# EAGLE schematic SCH1001-002-009-320 - ALU Top (EAGLE 9.4.2)

## Sheet 1 of 4
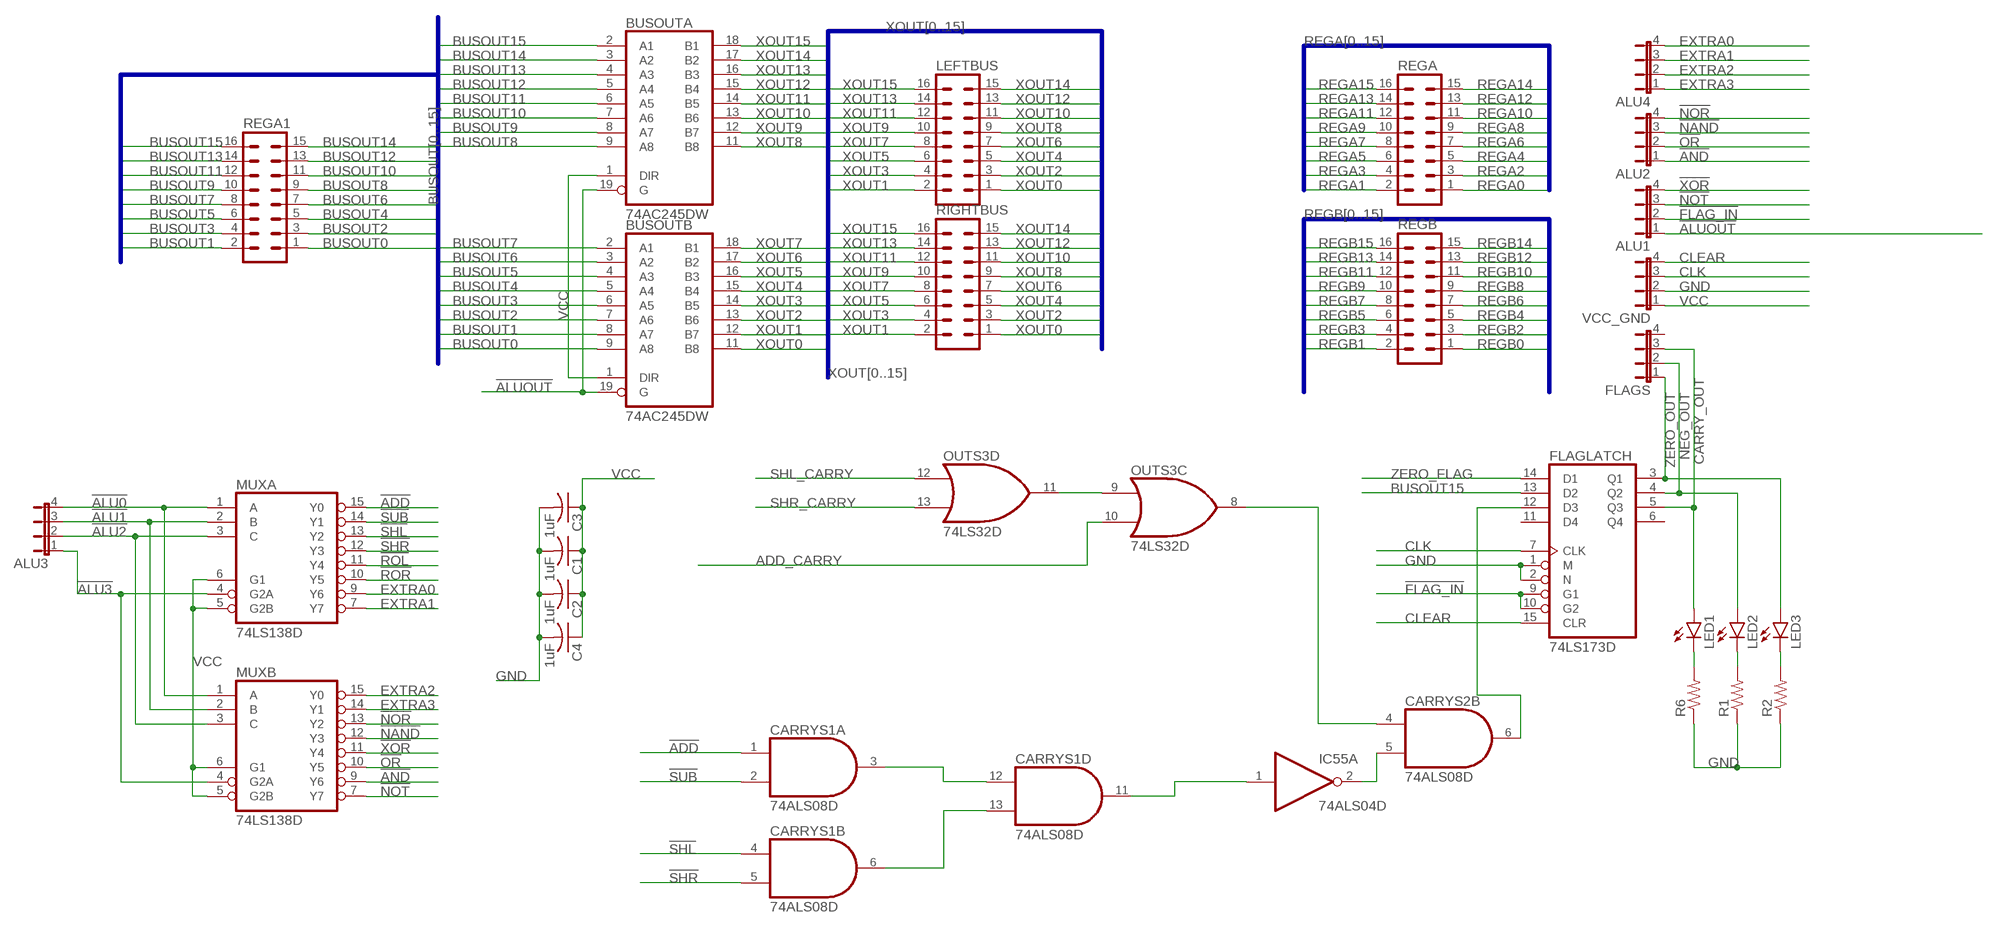
[diagram p0: schematic, sheet 1]

### Parts
ALU1  JP4E  [JP4]
ALU2  JP4E  [JP4]
ALU3  JP4E  [JP4]
ALU4  JP4E  [JP4]
BUSOUTA  74AC245DW  [SO20W]
BUSOUTB  74AC245DW  [SO20W]
C1  1uF  C-USC1206  [C1206]
C2  1uF  C-USC1206  [C1206]
C3  1uF  C-USC1206  [C1206]
C4  1uF  C-USC1206  [C1206]
CARRYS1  74ALS08D  [SO14]
CARRYS2  74ALS08D  [SO14]
FLAGLATCH  74LS173D  [SO16]
FLAGS  JP4E  [JP4]
IC55  74ALS04D  [SO14]
LED1  LED5MM  [LED5MM]
LED2  LED5MM  [LED5MM]
LED3  LED5MM  [LED5MM]
LEFTBUS  ML16  [ML16]
MUXA  74LS138D  [SO16]
MUXB  74LS138D  [SO16]
OUTS3  74LS32D  [SO14]
R1  R-US_M1206  [M1206]
R2  R-US_M1206  [M1206]
R6  R-US_M1206  [M1206]
REGA  ML16  [ML16]
REGA1  ML16  [ML16]
REGB  ML16  [ML16]
RIGHTBUS  ML16  [ML16]
VCC_GND  JP4E  [JP4]

### Nets
!ADD: CARRYS1.1(A:I0) MUXA.15(Y0) ; also sheet 4
!ALU0: ALU3.4 MUXA.1(A) MUXB.1(A)
!ALU1: ALU3.3 MUXA.2(B) MUXB.2(B)
!ALU2: ALU3.2 MUXA.3(C) MUXB.3(C)
!ALU3: ALU3.1 MUXA.4(G2A) MUXB.4(G2A)
!ALUOUT: ALU1.1 BUSOUTA.19(G) BUSOUTB.19(G)
!AND: ALU2.1 MUXB.9(Y6)
!FLAG_IN: ALU1.2 FLAGLATCH.9(G1) FLAGLATCH.10(G2)
!NAND: ALU2.3 MUXB.12(Y3)
!NOR: ALU2.4 MUXB.13(Y2)
!NOT: ALU1.3 MUXB.7(Y7)
!OR: ALU2.2 MUXB.10(Y5)
!ROL: MUXA.11(Y4) ; also sheet 2
!ROR: MUXA.10(Y5) ; also sheet 2
!SHL: CARRYS1.4(B:I0) MUXA.13(Y2) ; also sheet 2
!SHR: CARRYS1.5(B:I1) MUXA.12(Y3) ; also sheet 2
!SUB: CARRYS1.2(A:I1) MUXA.14(Y1) ; also sheet 4
!XOR: ALU1.4 MUXB.11(Y4)
ADD_CARRY: OUTS3.10(C:I1) ; also sheet 4
BUSOUT0: BUSOUTB.9(A8) REGA1.1 ; also sheet 2,4
BUSOUT1: BUSOUTB.8(A7) REGA1.2 ; also sheet 2,4
BUSOUT2: BUSOUTB.7(A6) REGA1.3 ; also sheet 2,4
BUSOUT3: BUSOUTB.6(A5) REGA1.4 ; also sheet 2,4
BUSOUT4: BUSOUTB.5(A4) REGA1.5 ; also sheet 2,4
BUSOUT5: BUSOUTB.4(A3) REGA1.6 ; also sheet 2,4
BUSOUT6: BUSOUTB.3(A2) REGA1.7 ; also sheet 2,4
BUSOUT7: BUSOUTB.2(A1) REGA1.8 ; also sheet 2,4
BUSOUT8: BUSOUTA.9(A8) REGA1.9 ; also sheet 2,4
BUSOUT9: BUSOUTA.8(A7) REGA1.10 ; also sheet 2,4
BUSOUT10: BUSOUTA.7(A6) REGA1.11 ; also sheet 2,4
BUSOUT11: BUSOUTA.6(A5) REGA1.12 ; also sheet 2,4
BUSOUT12: BUSOUTA.5(A4) REGA1.13 ; also sheet 2,4
BUSOUT13: BUSOUTA.4(A3) REGA1.14 ; also sheet 2,4
BUSOUT14: BUSOUTA.3(A2) REGA1.15 ; also sheet 2,4
BUSOUT15: BUSOUTA.2(A1) FLAGLATCH.13(D2) REGA1.16 ; also sheet 2,4
CARRY_OUT: FLAGLATCH.5(Q3) FLAGS.3 LED1.A
CLEAR: FLAGLATCH.15(CLR) VCC_GND.4
CLK: FLAGLATCH.7(CLK) VCC_GND.3
EXTRA0: ALU4.4 MUXA.9(Y6)
EXTRA1: ALU4.3 MUXA.7(Y7)
EXTRA2: ALU4.2 MUXB.15(Y0)
EXTRA3: ALU4.1 MUXB.14(Y1)
GND [power]: C1.2 C2.2 C3.2 C4.2 FLAGLATCH.1(M) FLAGLATCH.2(N) R1.1 R2.1 R6.1 VCC_GND.2 ; also sheet 2
N$115: OUTS3.9(C:I0) OUTS3.11(D:O)
N$118: CARRYS2.4(B:I0) OUTS3.8(C:O)
N$131: CARRYS2.6(B:O) FLAGLATCH.12(D3)
N$132: CARRYS2.5(B:I1) IC55.2(A:O)
N$134: CARRYS1.11(D:O) IC55.1(A:I)
N$135: CARRYS1.3(A:O) CARRYS1.12(D:I0)
N$136: CARRYS1.6(B:O) CARRYS1.13(D:I1)
N$138: LED1.K(C) R6.2
N$139: LED2.K(C) R1.2
N$140: LED3.K(C) R2.2
NEG_OUT: FLAGLATCH.4(Q2) FLAGS.2 LED2.A
REGA0: REGA.1 ; also sheet 2,4
REGA1: REGA.2 ; also sheet 2,4
REGA2: REGA.3 ; also sheet 2,4
REGA3: REGA.4 ; also sheet 2,4
REGA4: REGA.5 ; also sheet 2,4
REGA5: REGA.6 ; also sheet 2,4
REGA6: REGA.7 ; also sheet 2,4
REGA7: REGA.8 ; also sheet 2,4
REGA8: REGA.9 ; also sheet 2,4
REGA9: REGA.10 ; also sheet 2,4
REGA10: REGA.11 ; also sheet 2,4
REGA11: REGA.12 ; also sheet 2,4
REGA12: REGA.13 ; also sheet 2,4
REGA13: REGA.14 ; also sheet 2,4
REGA14: REGA.15 ; also sheet 2,4
REGA15: REGA.16 ; also sheet 2,4
REGB0: REGB.1 ; also sheet 4
REGB1: REGB.2 ; also sheet 4
REGB2: REGB.3 ; also sheet 4
REGB3: REGB.4 ; also sheet 4
REGB4: REGB.5 ; also sheet 4
REGB5: REGB.6 ; also sheet 4
REGB6: REGB.7 ; also sheet 4
REGB7: REGB.8 ; also sheet 4
REGB8: REGB.9 ; also sheet 4
REGB9: REGB.10 ; also sheet 4
REGB10: REGB.11 ; also sheet 4
REGB11: REGB.12 ; also sheet 4
REGB12: REGB.13 ; also sheet 4
REGB13: REGB.14 ; also sheet 4
REGB14: REGB.15 ; also sheet 4
REGB15: REGB.16 ; also sheet 4
SHL_CARRY: OUTS3.12(D:I0) ; also sheet 2
SHR_CARRY: OUTS3.13(D:I1) ; also sheet 2
VCC [power]: BUSOUTA.1(DIR) BUSOUTB.1(DIR) C1.1 C2.1 C3.1 C4.1 MUXA.5(G2B) MUXA.6(G1) MUXB.5(G2B) MUXB.6(G1) VCC_GND.1 ; also sheet 2,4
XOUT0: BUSOUTB.11(B8) LEFTBUS.1 RIGHTBUS.1
XOUT1: BUSOUTB.12(B7) LEFTBUS.2 RIGHTBUS.2
XOUT2: BUSOUTB.13(B6) LEFTBUS.3 RIGHTBUS.3
XOUT3: BUSOUTB.14(B5) LEFTBUS.4 RIGHTBUS.4
XOUT4: BUSOUTB.15(B4) LEFTBUS.5 RIGHTBUS.5
XOUT5: BUSOUTB.16(B3) LEFTBUS.6 RIGHTBUS.6
XOUT6: BUSOUTB.17(B2) LEFTBUS.7 RIGHTBUS.7
XOUT7: BUSOUTB.18(B1) LEFTBUS.8 RIGHTBUS.8
XOUT8: BUSOUTA.11(B8) LEFTBUS.9 RIGHTBUS.9
XOUT9: BUSOUTA.12(B7) LEFTBUS.10 RIGHTBUS.10
XOUT10: BUSOUTA.13(B6) LEFTBUS.11 RIGHTBUS.11
XOUT11: BUSOUTA.14(B5) LEFTBUS.12 RIGHTBUS.12
XOUT12: BUSOUTA.15(B4) LEFTBUS.13 RIGHTBUS.13
XOUT13: BUSOUTA.16(B3) LEFTBUS.14 RIGHTBUS.14
XOUT14: BUSOUTA.17(B2) LEFTBUS.15 RIGHTBUS.15
XOUT15: BUSOUTA.18(B1) LEFTBUS.16 RIGHTBUS.16
ZERO_FLAG: FLAGLATCH.14(D1) ; also sheet 4
ZERO_OUT: FLAGLATCH.3(Q1) FLAGS.1 LED3.A
Unconnected: CARRYS1.8(C:O) CARRYS1.9(C:I0) CARRYS1.10(C:I1) CARRYS2.1(A:I0) CARRYS2.2(A:I1) CARRYS2.3(A:O) CARRYS2.8(C:O) CARRYS2.9(C:I0) CARRYS2.10(C:I1) CARRYS2.11(D:O) CARRYS2.12(D:I0) CARRYS2.13(D:I1) FLAGLATCH.6(Q4) FLAGLATCH.11(D4) FLAGS.4 IC55.3(B:I) IC55.4(B:O) IC55.5(C:I) IC55.6(C:O) IC55.8(D:O) IC55.9(D:I) IC55.10(E:O) IC55.11(E:I) IC55.12(F:O) IC55.13(F:I) OUTS3.1(A:I0) OUTS3.2(A:I1) OUTS3.3(A:O) OUTS3.4(B:I0) OUTS3.5(B:I1) OUTS3.6(B:O)

### Buses
REGB[0..15]
REGA[0..15]
XOUT[0..15]
BUSOUT[0..15]

## Sheet 2 of 4
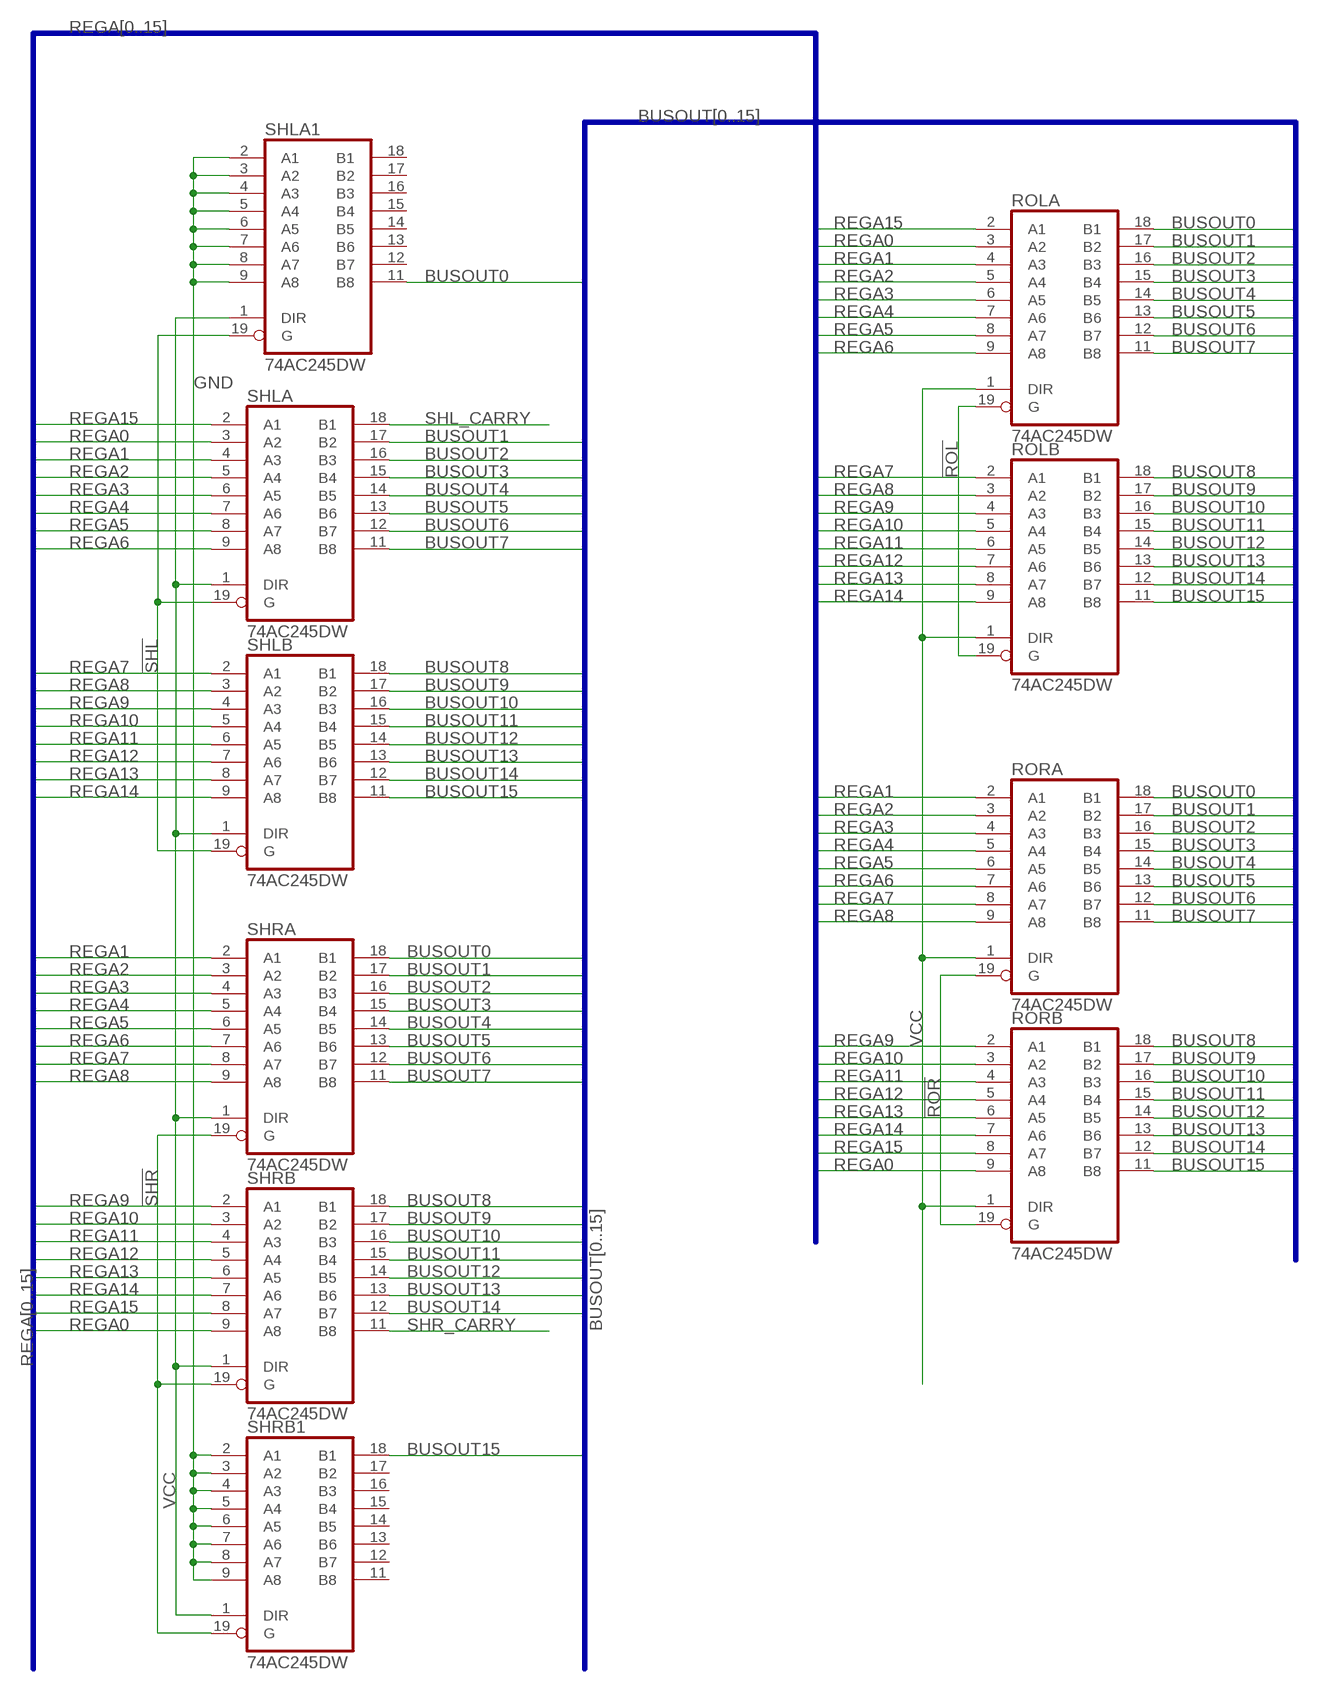
[diagram p1: schematic, sheet 2]

### Parts
ROLA  74AC245DW  [SO20W]
ROLB  74AC245DW  [SO20W]
RORA  74AC245DW  [SO20W]
RORB  74AC245DW  [SO20W]
SHLA  74AC245DW  [SO20W]
SHLA1  74AC245DW  [SO20W]
SHLB  74AC245DW  [SO20W]
SHRA  74AC245DW  [SO20W]
SHRB  74AC245DW  [SO20W]
SHRB1  74AC245DW  [SO20W]

### Nets
!ROL: ROLA.19(G) ROLB.19(G) ; also sheet 1
!ROR: RORA.19(G) RORB.19(G) ; also sheet 1
!SHL: SHLA1.19(G) SHLA.19(G) SHLB.19(G) ; also sheet 1
!SHR: SHRA.19(G) SHRB1.19(G) SHRB.19(G) ; also sheet 1
BUSOUT0: ROLA.18(B1) RORA.18(B1) SHLA1.11(B8) SHRA.18(B1) ; also sheet 1,4
BUSOUT1: ROLA.17(B2) RORA.17(B2) SHLA.17(B2) SHRA.17(B2) ; also sheet 1,4
BUSOUT2: ROLA.16(B3) RORA.16(B3) SHLA.16(B3) SHRA.16(B3) ; also sheet 1,4
BUSOUT3: ROLA.15(B4) RORA.15(B4) SHLA.15(B4) SHRA.15(B4) ; also sheet 1,4
BUSOUT4: ROLA.14(B5) RORA.14(B5) SHLA.14(B5) SHRA.14(B5) ; also sheet 1,4
BUSOUT5: ROLA.13(B6) RORA.13(B6) SHLA.13(B6) SHRA.13(B6) ; also sheet 1,4
BUSOUT6: ROLA.12(B7) RORA.12(B7) SHLA.12(B7) SHRA.12(B7) ; also sheet 1,4
BUSOUT7: ROLA.11(B8) RORA.11(B8) SHLA.11(B8) SHRA.11(B8) ; also sheet 1,4
BUSOUT8: ROLB.18(B1) RORB.18(B1) SHLB.18(B1) SHRB.18(B1) ; also sheet 1,4
BUSOUT9: ROLB.17(B2) RORB.17(B2) SHLB.17(B2) SHRB.17(B2) ; also sheet 1,4
BUSOUT10: ROLB.16(B3) RORB.16(B3) SHLB.16(B3) SHRB.16(B3) ; also sheet 1,4
BUSOUT11: ROLB.15(B4) RORB.15(B4) SHLB.15(B4) SHRB.15(B4) ; also sheet 1,4
BUSOUT12: ROLB.14(B5) RORB.14(B5) SHLB.14(B5) SHRB.14(B5) ; also sheet 1,4
BUSOUT13: ROLB.13(B6) RORB.13(B6) SHLB.13(B6) SHRB.13(B6) ; also sheet 1,4
BUSOUT14: ROLB.12(B7) RORB.12(B7) SHLB.12(B7) SHRB.12(B7) ; also sheet 1,4
BUSOUT15: ROLB.11(B8) RORB.11(B8) SHLB.11(B8) SHRB1.18(B1) ; also sheet 1,4
GND [power]: SHLA1.2(A1) SHLA1.3(A2) SHLA1.4(A3) SHLA1.5(A4) SHLA1.6(A5) SHLA1.7(A6) SHLA1.8(A7) SHLA1.9(A8) SHRB1.2(A1) SHRB1.3(A2) SHRB1.4(A3) SHRB1.5(A4) SHRB1.6(A5) SHRB1.7(A6) SHRB1.8(A7) SHRB1.9(A8) ; also sheet 1
REGA0: ROLA.3(A2) RORB.9(A8) SHLA.3(A2) SHRB.9(A8) ; also sheet 1,4
REGA1: ROLA.4(A3) RORA.2(A1) SHLA.4(A3) SHRA.2(A1) ; also sheet 1,4
REGA2: ROLA.5(A4) RORA.3(A2) SHLA.5(A4) SHRA.3(A2) ; also sheet 1,4
REGA3: ROLA.6(A5) RORA.4(A3) SHLA.6(A5) SHRA.4(A3) ; also sheet 1,4
REGA4: ROLA.7(A6) RORA.5(A4) SHLA.7(A6) SHRA.5(A4) ; also sheet 1,4
REGA5: ROLA.8(A7) RORA.6(A5) SHLA.8(A7) SHRA.6(A5) ; also sheet 1,4
REGA6: ROLA.9(A8) RORA.7(A6) SHLA.9(A8) SHRA.7(A6) ; also sheet 1,4
REGA7: ROLB.2(A1) RORA.8(A7) SHLB.2(A1) SHRA.8(A7) ; also sheet 1,4
REGA8: ROLB.3(A2) RORA.9(A8) SHLB.3(A2) SHRA.9(A8) ; also sheet 1,4
REGA9: ROLB.4(A3) RORB.2(A1) SHLB.4(A3) SHRB.2(A1) ; also sheet 1,4
REGA10: ROLB.5(A4) RORB.3(A2) SHLB.5(A4) SHRB.3(A2) ; also sheet 1,4
REGA11: ROLB.6(A5) RORB.4(A3) SHLB.6(A5) SHRB.4(A3) ; also sheet 1,4
REGA12: ROLB.7(A6) RORB.5(A4) SHLB.7(A6) SHRB.5(A4) ; also sheet 1,4
REGA13: ROLB.8(A7) RORB.6(A5) SHLB.8(A7) SHRB.6(A5) ; also sheet 1,4
REGA14: ROLB.9(A8) RORB.7(A6) SHLB.9(A8) SHRB.7(A6) ; also sheet 1,4
REGA15: ROLA.2(A1) RORB.8(A7) SHLA.2(A1) SHRB.8(A7) ; also sheet 1,4
SHL_CARRY: SHLA.18(B1) ; also sheet 1
SHR_CARRY: SHRB.11(B8) ; also sheet 1
VCC [power]: ROLA.1(DIR) ROLB.1(DIR) RORA.1(DIR) RORB.1(DIR) SHLA1.1(DIR) SHLA.1(DIR) SHLB.1(DIR) SHRA.1(DIR) SHRB1.1(DIR) SHRB.1(DIR) ; also sheet 1,4
Unconnected: SHLA1.12(B7) SHLA1.13(B6) SHLA1.14(B5) SHLA1.15(B4) SHLA1.16(B3) SHLA1.17(B2) SHLA1.18(B1) SHRB1.11(B8) SHRB1.12(B7) SHRB1.13(B6) SHRB1.14(B5) SHRB1.15(B4) SHRB1.16(B3) SHRB1.17(B2)

### Buses
BUSOUT[0..15]
REGA[0..15]

## Sheet 3 of 4

## Sheet 4 of 4
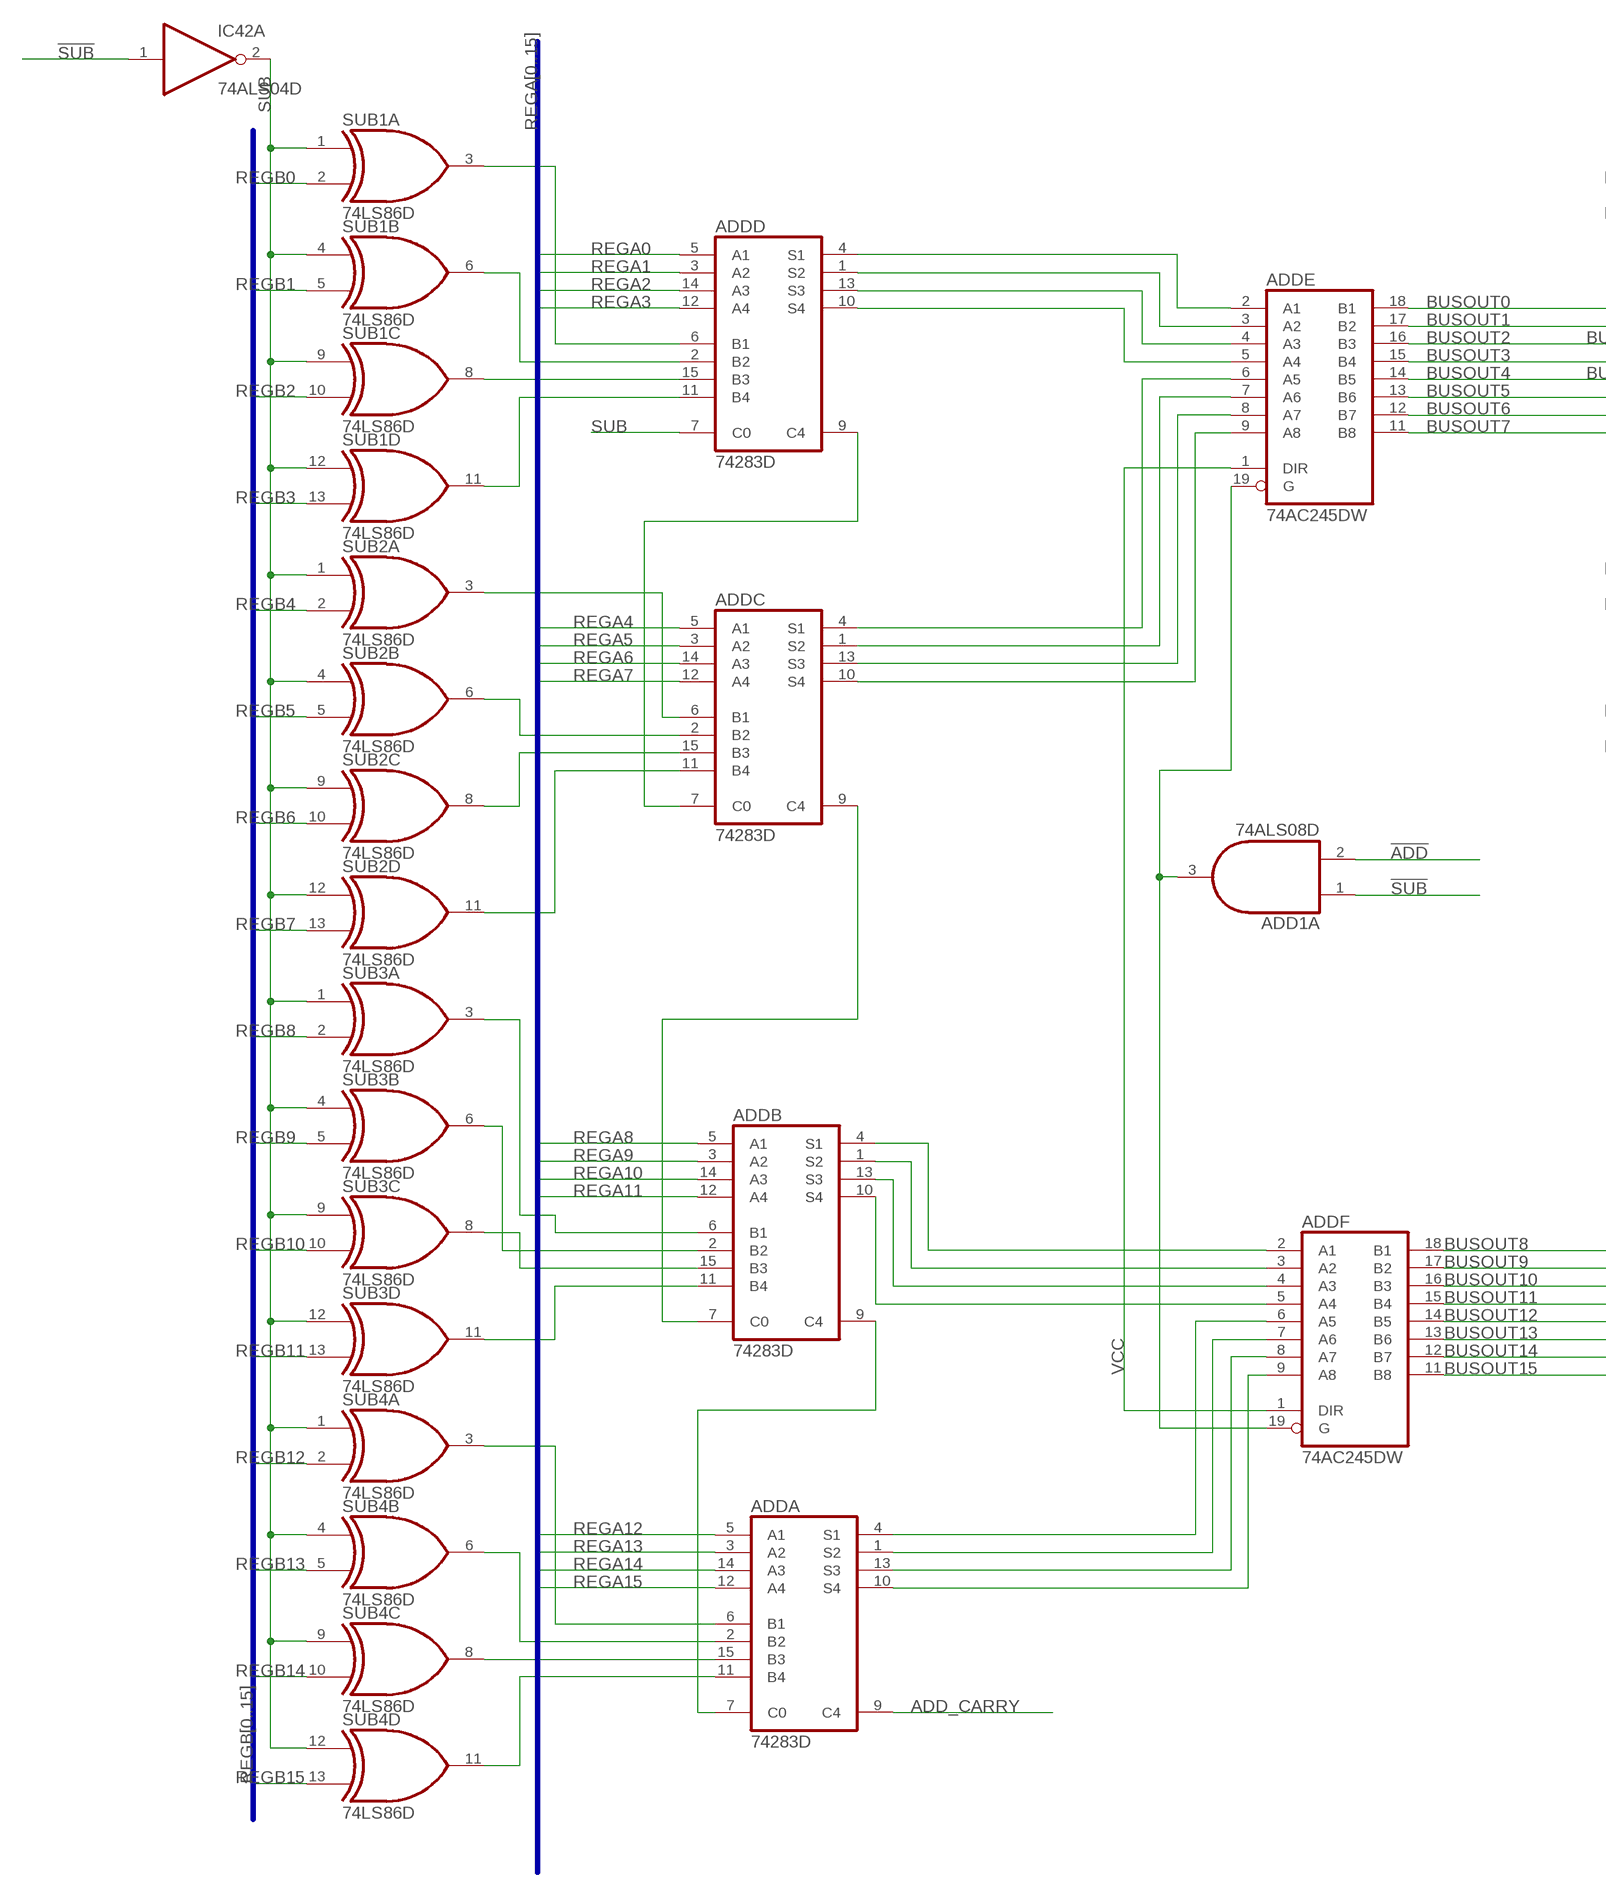
[diagram p2: schematic, sheet 4, part 1 of 2]
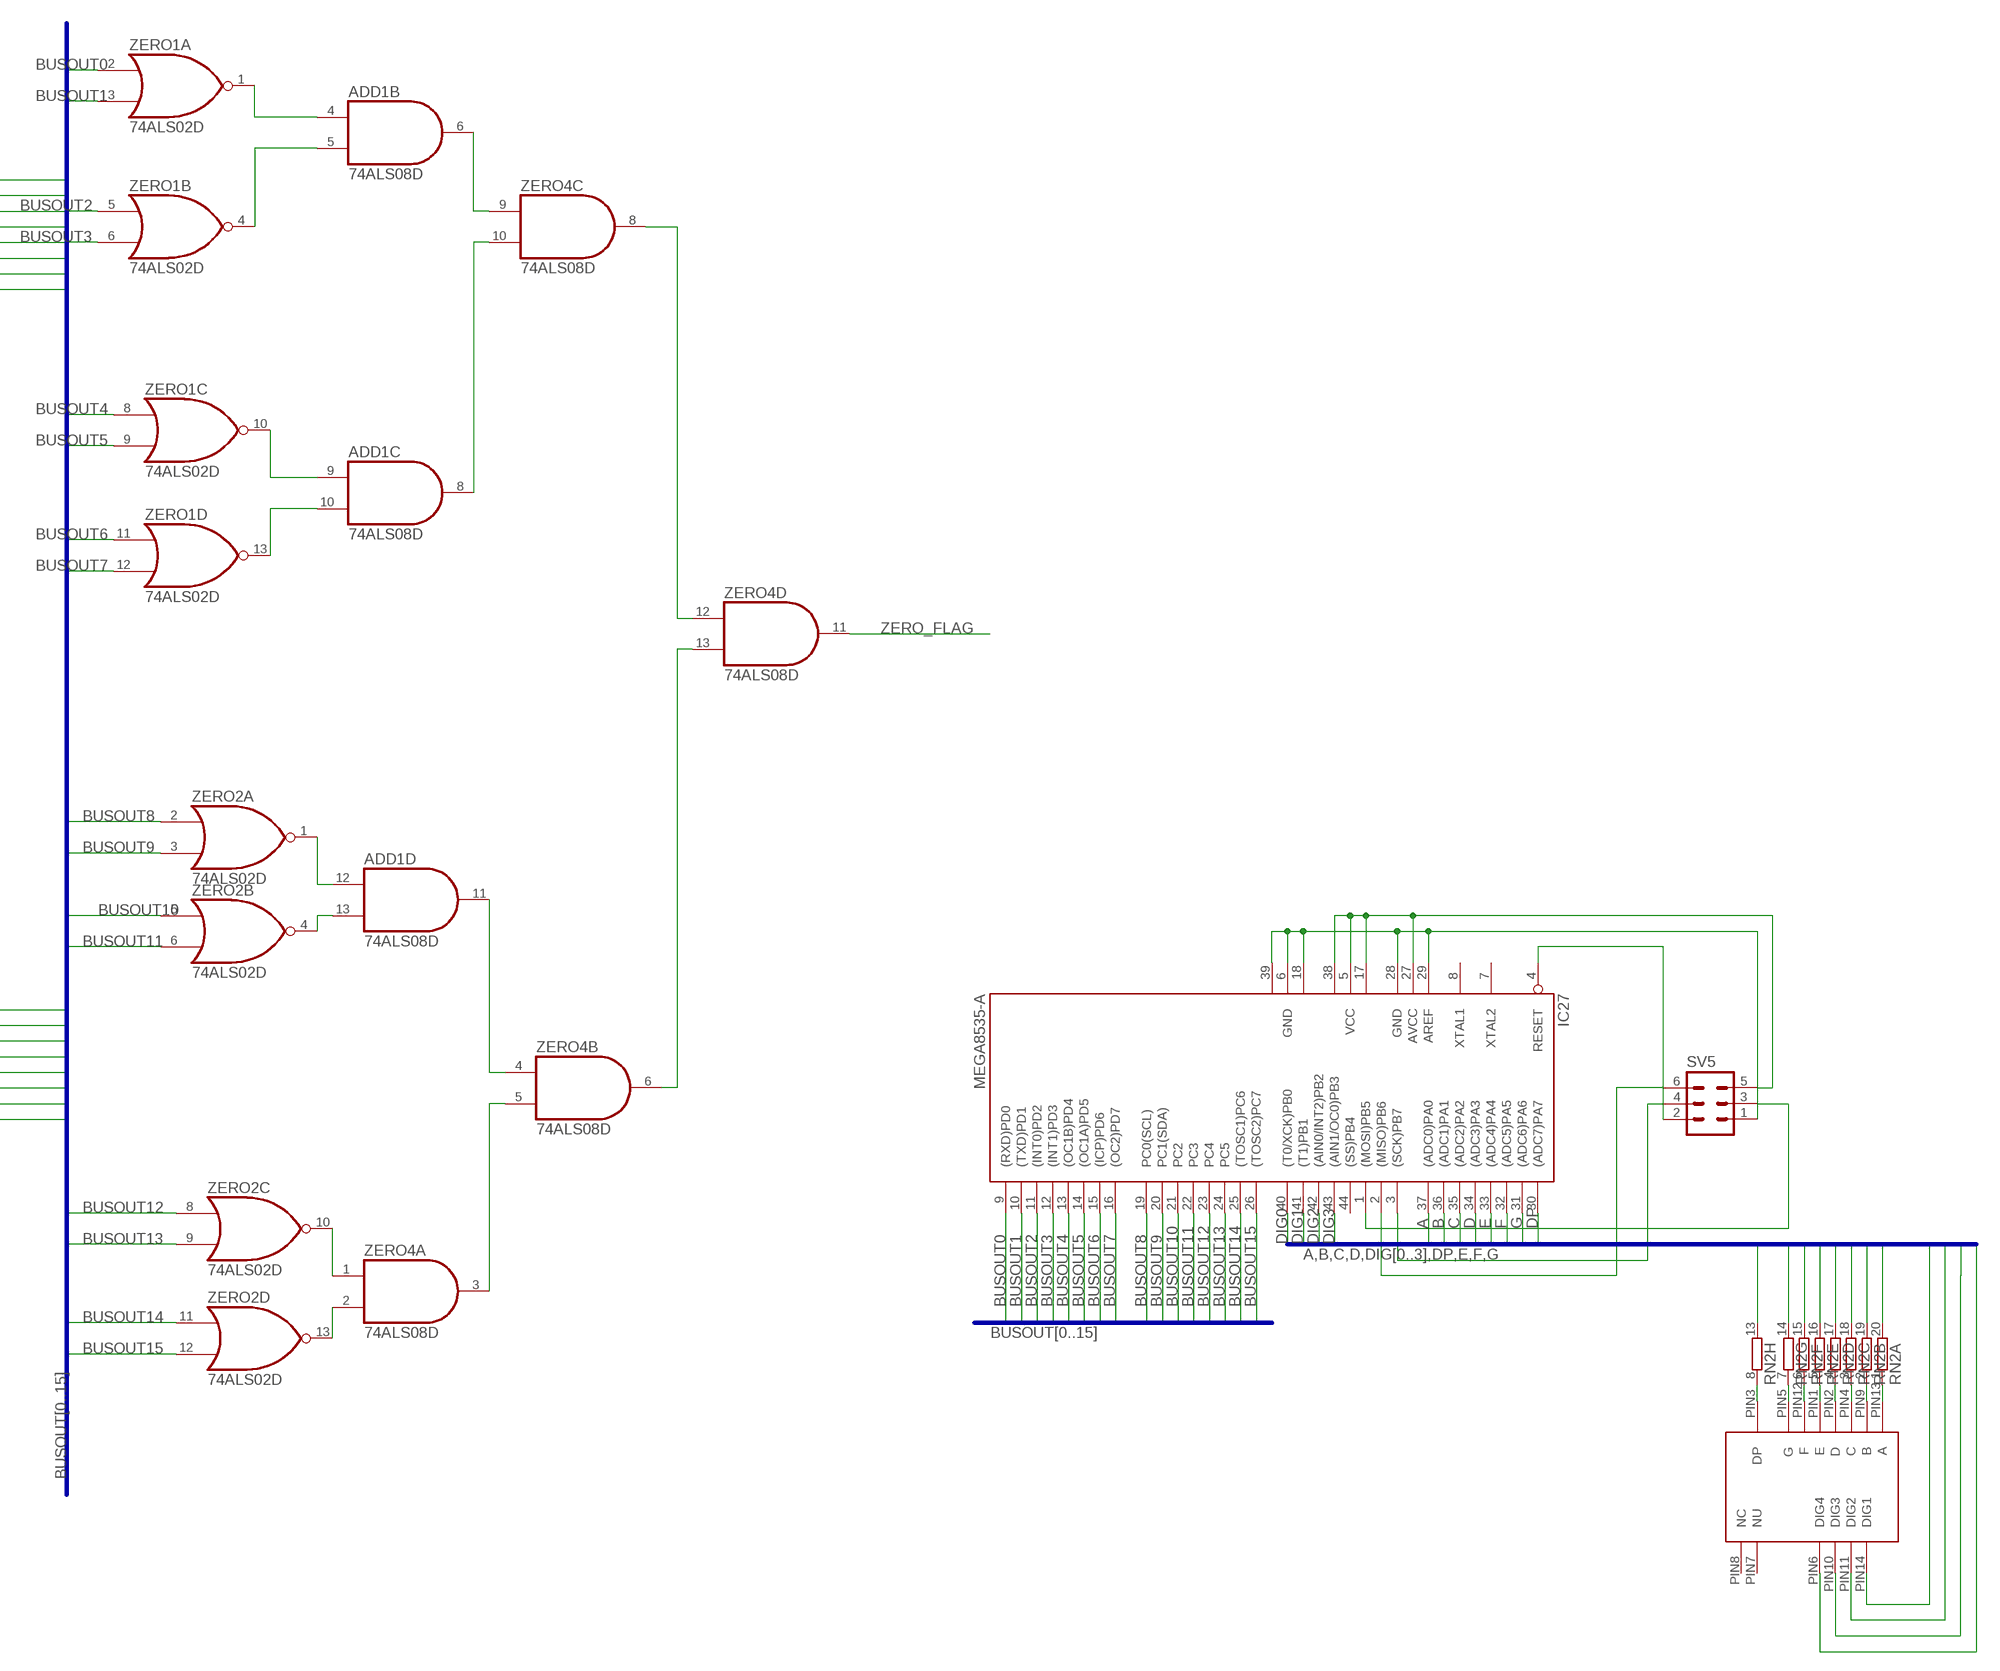
[diagram p3: schematic, sheet 4, part 2 of 2]

### Parts
ADD1  74ALS08D  [SO14]
ADDA  74283D  [SO16]
ADDB  74283D  [SO16]
ADDC  74283D  [SO16]
ADDD  74283D  [SO16]
ADDE  74AC245DW  [SO20W]
ADDF  74AC245DW  [SO20W]
IC27  MEGA8535-A  [TQFP44]
IC42  74ALS04D  [SO14]
RN2  10R-NSOMC  [SOMC20]
SUB1  74LS86D  [SO14]
SUB2  74LS86D  [SO14]
SUB3  74LS86D  [SO14]
SUB4  74LS86D  [SO14]
SV5  ML6  [ML6]
U$1  4-DIGIT-7-SEGMENT  [4-DIGIT-7-SEGMENT]
ZERO1  74ALS02D  [SO14]
ZERO2  74ALS02D  [SO14]
ZERO4  74ALS08D  [SO14]

### Nets
!ADD: ADD1.2(A:I1) ; also sheet 1
!SUB: ADD1.1(A:I0) IC42.1(A:I) ; also sheet 1
A: IC27.37((ADC0)PA0) RN2.20
ADD_CARRY: ADDA.9(C4) ; also sheet 1
B: IC27.36((ADC1)PA1) RN2.19
BUSOUT0: ADDE.18(B1) IC27.9((RXD)PD0) ZERO1.2(A:I0) ; also sheet 1,2
BUSOUT1: ADDE.17(B2) IC27.10((TXD)PD1) ZERO1.3(A:I1) ; also sheet 1,2
BUSOUT2: ADDE.16(B3) IC27.11((INT0)PD2) ZERO1.5(B:I0) ; also sheet 1,2
BUSOUT3: ADDE.15(B4) IC27.12((INT1)PD3) ZERO1.6(B:I1) ; also sheet 1,2
BUSOUT4: ADDE.14(B5) IC27.13((OC1B)PD4) ZERO1.8(C:I0) ; also sheet 1,2
BUSOUT5: ADDE.13(B6) IC27.14((OC1A)PD5) ZERO1.9(C:I1) ; also sheet 1,2
BUSOUT6: ADDE.12(B7) IC27.15((ICP)PD6) ZERO1.11(D:I0) ; also sheet 1,2
BUSOUT7: ADDE.11(B8) IC27.16((OC2)PD7) ZERO1.12(D:I1) ; also sheet 1,2
BUSOUT8: ADDF.18(B1) IC27.19(PC0(SCL)) ZERO2.2(A:I0) ; also sheet 1,2
BUSOUT9: ADDF.17(B2) IC27.20(PC1(SDA)) ZERO2.3(A:I1) ; also sheet 1,2
BUSOUT10: ADDF.16(B3) IC27.21(PC2) ZERO2.5(B:I0) ; also sheet 1,2
BUSOUT11: ADDF.15(B4) IC27.22(PC3) ZERO2.6(B:I1) ; also sheet 1,2
BUSOUT12: ADDF.14(B5) IC27.23(PC4) ZERO2.8(C:I0) ; also sheet 1,2
BUSOUT13: ADDF.13(B6) IC27.24(PC5) ZERO2.9(C:I1) ; also sheet 1,2
BUSOUT14: ADDF.12(B7) IC27.25((TOSC1)PC6) ZERO2.11(D:I0) ; also sheet 1,2
BUSOUT15: ADDF.11(B8) IC27.26((TOSC2)PC7) ZERO2.12(D:I1) ; also sheet 1,2
C: IC27.35((ADC2)PA2) RN2.18
D: IC27.34((ADC3)PA3) RN2.17
DIG0: IC27.40((T0/XCK)PB0) U$1.PIN14(DIG1)
DIG1: IC27.41((T1)PB1) U$1.PIN11(DIG2)
DIG2: IC27.42((AIN0/INT2)PB2) U$1.PIN10(DIG3)
DIG3: IC27.43((AIN1/OC0)PB3) U$1.PIN6(DIG4)
DP: IC27.30((ADC7)PA7) RN2.13
E: IC27.33((ADC4)PA4) RN2.16
F: IC27.32((ADC5)PA5) RN2.15
G: IC27.31((ADC6)PA6) RN2.14
N$65: ADDD.6(B1) SUB1.3(A:O)
N$66: ADDD.2(B2) SUB1.6(B:O)
N$67: ADDD.15(B3) SUB1.8(C:O)
N$68: ADDD.11(B4) SUB1.11(D:O)
N$69: ADDD.4(S1) ADDE.2(A1)
N$70: ADDD.1(S2) ADDE.3(A2)
N$73: ADDC.10(S4) ADDE.9(A8)
N$74: ADDC.13(S3) ADDE.8(A7)
N$75: ADDC.1(S2) ADDE.7(A6)
N$76: ADDC.4(S1) ADDE.6(A5)
N$77: ADDC.6(B1) SUB2.3(A:O)
N$78: ADDC.2(B2) SUB2.6(B:O)
N$79: ADDC.15(B3) SUB2.8(C:O)
N$80: ADDC.11(B4) SUB2.11(D:O)
N$81: ADDC.7(C0) ADDD.9(C4)
N$82: ADDA.2(B2) SUB4.6(B:O)
N$83: ADDA.15(B3) SUB4.8(C:O)
N$84: ADDA.11(B4) SUB4.11(D:O)
N$85: ADDA.6(B1) SUB4.3(A:O)
N$86: ADDA.7(C0) ADDB.9(C4)
N$87: ADDA.10(S4) ADDF.9(A8)
N$88: ADDA.13(S3) ADDF.8(A7)
N$89: ADDA.1(S2) ADDF.7(A6)
N$90: ADDA.4(S1) ADDF.6(A5)
N$91: ADDB.11(B4) SUB3.11(D:O)
N$92: ADDB.15(B3) SUB3.8(C:O)
N$93: ADDB.2(B2) SUB3.6(B:O)
N$94: ADDB.6(B1) SUB3.3(A:O)
N$95: ADDB.7(C0) ADDC.9(C4)
N$96: ADDB.10(S4) ADDF.5(A4)
N$97: ADDB.13(S3) ADDF.4(A3)
N$98: ADDB.1(S2) ADDF.3(A2)
N$99: ADDB.4(S1) ADDF.2(A1)
N$100: ADD1.3(A:O) ADDE.19(G) ADDF.19(G)
N$101: ADD1.4(B:I0) ZERO1.1(A:O)
N$102: ADD1.5(B:I1) ZERO1.4(B:O)
N$103: ADD1.9(C:I0) ZERO1.10(C:O)
N$104: ADD1.10(C:I1) ZERO1.13(D:O)
N$105: ADD1.8(C:O) ZERO4.10(C:I1)
N$106: ADD1.6(B:O) ZERO4.9(C:I0)
N$107: ZERO4.8(C:O) ZERO4.12(D:I0)
N$108: ZERO4.6(B:O) ZERO4.13(D:I1)
N$109: ADD1.11(D:O) ZERO4.4(B:I0)
N$110: ZERO4.3(A:O) ZERO4.5(B:I1)
N$111: ZERO2.10(C:O) ZERO4.1(A:I0)
N$112: ZERO2.13(D:O) ZERO4.2(A:I1)
N$113: ADD1.12(D:I0) ZERO2.1(A:O)
N$114: ADD1.13(D:I1) ZERO2.4(B:O)
N$116: ADDD.13(S3) ADDE.4(A3)
N$117: ADDD.10(S4) ADDE.5(A4)
N$120: IC27.1((MOSI)PB5) SV5.3
N$121: IC27.3((SCK)PB7) SV5.4
N$122: IC27.2((MISO)PB6) SV5.6
N$123: IC27.4(RESET) SV5.2
N$124: RN2.1 U$1.PIN13(A)
N$125: RN2.2 U$1.PIN9(B)
N$126: RN2.3 U$1.PIN4(C)
N$127: RN2.4 U$1.PIN2(D)
N$128: RN2.5 U$1.PIN1(E)
N$129: RN2.6 U$1.PIN12(F)
N$130: RN2.7 U$1.PIN5(G)
N$141: RN2.8 U$1.PIN3(DP)
N$142: IC27.5(VCC) IC27.17(VCC1) IC27.27(AVCC) IC27.38(VCC2) SV5.5
N$143: IC27.6(GND) IC27.18(GND1) IC27.28(GND) IC27.29(AREF) IC27.39(GND2) SV5.1
REGA0: ADDD.5(A1) ; also sheet 1,2
REGA1: ADDD.3(A2) ; also sheet 1,2
REGA2: ADDD.14(A3) ; also sheet 1,2
REGA3: ADDD.12(A4) ; also sheet 1,2
REGA4: ADDC.5(A1) ; also sheet 1,2
REGA5: ADDC.3(A2) ; also sheet 1,2
REGA6: ADDC.14(A3) ; also sheet 1,2
REGA7: ADDC.12(A4) ; also sheet 1,2
REGA8: ADDB.5(A1) ; also sheet 1,2
REGA9: ADDB.3(A2) ; also sheet 1,2
REGA10: ADDB.14(A3) ; also sheet 1,2
REGA11: ADDB.12(A4) ; also sheet 1,2
REGA12: ADDA.5(A1) ; also sheet 1,2
REGA13: ADDA.3(A2) ; also sheet 1,2
REGA14: ADDA.14(A3) ; also sheet 1,2
REGA15: ADDA.12(A4) ; also sheet 1,2
REGB0: SUB1.2(A:I1) ; also sheet 1
REGB1: SUB1.5(B:I1) ; also sheet 1
REGB2: SUB1.10(C:I1) ; also sheet 1
REGB3: SUB1.13(D:I1) ; also sheet 1
REGB4: SUB2.2(A:I1) ; also sheet 1
REGB5: SUB2.5(B:I1) ; also sheet 1
REGB6: SUB2.10(C:I1) ; also sheet 1
REGB7: SUB2.13(D:I1) ; also sheet 1
REGB8: SUB3.2(A:I1) ; also sheet 1
REGB9: SUB3.5(B:I1) ; also sheet 1
REGB10: SUB3.10(C:I1) ; also sheet 1
REGB11: SUB3.13(D:I1) ; also sheet 1
REGB12: SUB4.2(A:I1) ; also sheet 1
REGB13: SUB4.5(B:I1) ; also sheet 1
REGB14: SUB4.10(C:I1) ; also sheet 1
REGB15: SUB4.13(D:I1) ; also sheet 1
SUB: ADDD.7(C0) IC42.2(A:O) SUB1.1(A:I0) SUB1.4(B:I0) SUB1.9(C:I0) SUB1.12(D:I0) SUB2.1(A:I0) SUB2.4(B:I0) SUB2.9(C:I0) SUB2.12(D:I0) SUB3.1(A:I0) SUB3.4(B:I0) SUB3.9(C:I0) SUB3.12(D:I0) SUB4.1(A:I0) SUB4.4(B:I0) SUB4.9(C:I0) SUB4.12(D:I0)
VCC [power]: ADDE.1(DIR) ADDF.1(DIR) ; also sheet 1,2
ZERO_FLAG: ZERO4.11(D:O) ; also sheet 1
Unconnected: IC27.7(XTAL2) IC27.8(XTAL1) IC27.44((SS)PB4) IC42.3(B:I) IC42.4(B:O) IC42.5(C:I) IC42.6(C:O) IC42.8(D:O) IC42.9(D:I) IC42.10(E:O) IC42.11(E:I) IC42.12(F:O) IC42.13(F:I) RN2.9 RN2.10 RN2.11 RN2.12 U$1.PIN7(NU) U$1.PIN8(NC)

### Buses
REGB[0..15]
BUSOUT[0..15]
REGA[0..15]
A,B,C,D,DIG[0..3],DP,E,F,G

## Power pins joined to a net without a drawn wire
GND: ADD1.7(P:GND) ADDA.8(GND) ADDB.8(GND) ADDC.8(GND) ADDD.8(GND) ADDE.10(GND) ADDF.10(GND) BUSOUTA.10(GND) BUSOUTB.10(GND) CARRYS1.7(P:GND) CARRYS2.7(P:GND) FLAGLATCH.8(GND) IC42.7(P:GND) IC55.7(P:GND) MUXA.8(GND) MUXB.8(GND) OUTS3.7(P:GND) ROLA.10(GND) ROLB.10(GND) RORA.10(GND) RORB.10(GND) SHLA1.10(GND) SHLA.10(GND) SHLB.10(GND) SHRA.10(GND) SHRB1.10(GND) SHRB.10(GND) SUB1.7(P:GND) SUB2.7(P:GND) SUB3.7(P:GND) SUB4.7(P:GND) ZERO1.7(P:GND) ZERO2.7(P:GND) ZERO4.7(P:GND)
VCC: ADD1.14(P:VCC) ADDA.16(VCC) ADDB.16(VCC) ADDC.16(VCC) ADDD.16(VCC) ADDE.20(VCC) ADDF.20(VCC) BUSOUTA.20(VCC) BUSOUTB.20(VCC) CARRYS1.14(P:VCC) CARRYS2.14(P:VCC) FLAGLATCH.16(VCC) IC42.14(P:VCC) IC55.14(P:VCC) MUXA.16(VCC) MUXB.16(VCC) OUTS3.14(P:VCC) ROLA.20(VCC) ROLB.20(VCC) RORA.20(VCC) RORB.20(VCC) SHLA1.20(VCC) SHLA.20(VCC) SHLB.20(VCC) SHRA.20(VCC) SHRB1.20(VCC) SHRB.20(VCC) SUB1.14(P:VCC) SUB2.14(P:VCC) SUB3.14(P:VCC) SUB4.14(P:VCC) ZERO1.14(P:VCC) ZERO2.14(P:VCC) ZERO4.14(P:VCC)

## Library data of the parts
ADD1 CARRYS1 CARRYS2 ZERO4 = 74xx-us:74*08: Quad 2-input AND gate
ADDA ADDB ADDC ADDD = 74xx-us:74*283: 4-bit binary FULL ADDER, fast carry
ADDE ADDF BUSOUTA BUSOUTB ROLA ROLB RORA RORB SHLA SHLA1 SHLB SHRA SHRB SHRB1 = 74xx-eu:74*245: Octal BUS TRANSCEIVER, 3-state
ALU1-ALU4 FLAGS VCC_GND = jumper:JP4E: JUMPER
C1-C4 = rcl:C-US: CAPACITOR, American symbol; SPICEPREFIX: C
FLAGLATCH = 74xx-us:74*173: 4-bit D type REGISTER, 3-state
IC27 = atmel:MEGA8535: MICROCONTROLLER 8 Kbytes FLASH 512 bytes SRAM 512 bytes EEPROM USART 8-channel 10 bit ADC Source: avr.lbr; MPN: ATMEGA8535-16AU; OC_FARNELL: 1528437; OC_NEWARK: 01M6908
IC42 IC55 = 74xx-us:74*04: Hex INVERTER
LED1-LED3 = led:LED: LED OSRAM: - CHIPLED LG R971, LG N971, LY N971, LG Q971, LY Q971, LO R971, LY R971 LH N974, LH R974 LS Q976, LO Q976, LY Q976 LO Q996 - Hyper CHIPLED LW Q18S LB Q993, LB Q99A, LB R99A - SideLED LS A670, LO A670, LY A670, LG A670, LP A670 LB A673, LV A673, LT A673, LW A673 LH A674 LY A675 LS A676, LA A676, LO A676, LY A676, LW A676 LS A679, LY A679, LG A679 - Hyper Micro SIDELED® LS Y876, LA Y876, LO Y876, LY Y876 LT Y87S - SmartLED LW L88C, LW L88S LB L89C, LB L89S, LG L890 LS L89K, LO L89K, LY L89K LS L896, LA L896, LO L896, LY L896 - TOPLED LS T670, LO T670, LY T670, LG T670, LP T670 LSG T670, LSP T670, LSY T670, LOP T670, LYG T670 LG T671, LOG T671, LSG T671 LB T673, LV T673, LT T673, LW T673 LH T674 LS T676, LA T676, LO T676, LY T676, LB T676, LH T676, LSB T676, LW T676 LB T67C, LV T67C, LT T67C, LS T67K, LO T67K, LY T67K, LW E67C LS E67B, LA E67B, LO E67B, LY E67B, LB E67C, LV E67C, LT E67C LW T67C LS T679, LY T679, LG T679 LS T770, LO T770, LY T770, LG T770, LP T770 LB T773, LV T773, LT T773, LW T773 LH T774 LS E675, LA E675, LY E675, LS T675 LS T776, LA T776, LO T776, LY T776, LB T776 LHGB T686 LT T68C, LB T68C - Hyper Mini TOPLED® LB M676 - Mini TOPLED Santana® LG M470 LS M47K, LO M47K, LY M47K Source: http://www.osram.convergy.de LUXEON: - LUMILED® LXK2-PW12-R00, LXK2-PW12-S00, LXK2-PW14-U00, LXK2-PW14-V00 LXK2-PM12-R00, LXK2-PM12-S00, LXK2-PM14-U00 LXK2-PE12-Q00, LXK2-PE12-R00, LXK2-PE12-S00, LXK2-PE14-T00, LXK2-PE14-U00 LXK2-PB12-K00, LXK2-PB12-L00, LXK2-PB12-M00, LXK2-PB14-N00, LXK2-PB14-P00, LXK2-PB14-Q00 LXK2-PR12-L00, LXK2-PR12-M00, LXK2-PR14-Q00, LXK2-PR14-R00 LXK2-PD12-Q00, LXK2-PD12-R00, LXK2-PD12-S00 LXK2-PH12-R00, LXK2-PH12-S00 LXK2-PL12-P00, LXK2-PL12-Q00, LXK2-PL12-R00 Source: www.luxeon.com KINGBRIGHT: KA-3528ASYC Source: www.kingbright.com
LEFTBUS REGA REGA1 REGB RIGHTBUS = con-harting-ml:ML16: HARTING; OC_FARNELL: unknown; OC_NEWARK: unknown
MUXA MUXB = 74xx-us:74*138: 3-line to 8-line DECODER/DEMULTIPLEXER
OUTS3 = 74xx-us:74*32: Quad 2-input OR gate
R1 R2 R6 = rcl:R-US_: RESISTOR, American symbol; SPICEPREFIX: R
RN2 = resistor-dil:10R-N: DIL RESISTOR; OC_FARNELL: unknown; OC_NEWARK: unknown
SUB1-SUB4 = 74xx-us:74*86: Quad 2-input EXCLUSIV-OR (XOR) gate
SV5 = con-harting-ml:ML6: HARTING; OC_FARNELL: unknown; OC_NEWARK: unknown
U$1 = ADAFRUIT:4-DIGIT-7-SEGMENT
ZERO1 ZERO2 = 74xx-us:74*02: Quad 2-input NOR gate

## Net classes
1 power: width 0.457 mm